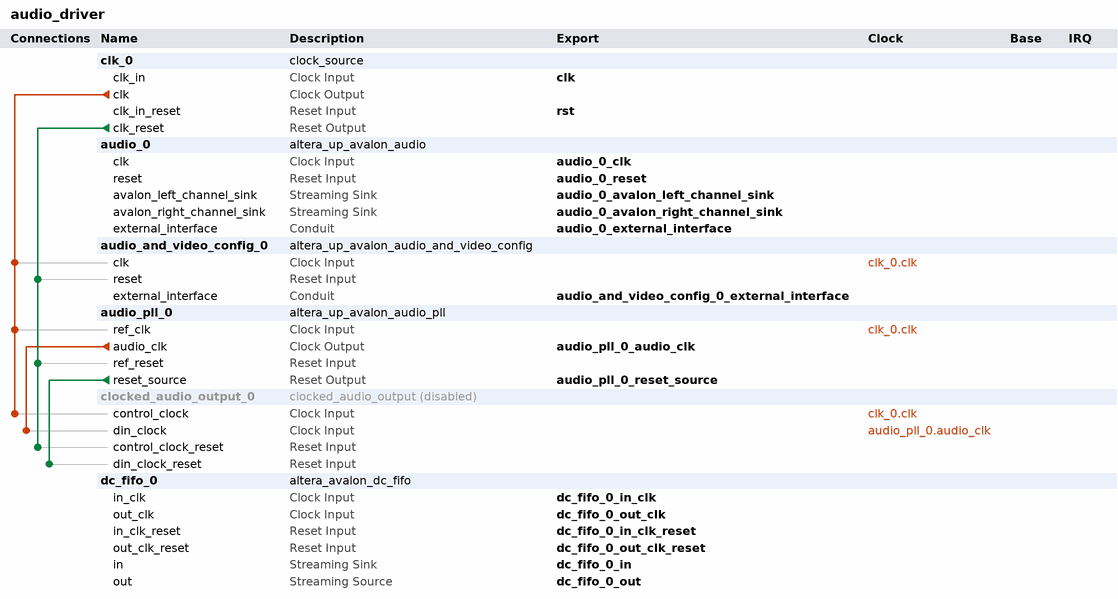
[diagram p0: system contents]
# Platform Designer (Qsys) system audio_driver, Cyclone V 5CSEMA5F31C6
# Parameters at their usual value, and those the tool derives, are not listed.
package require -exact qsys 18.0
create_system audio_driver
set_project_property DEVICE_FAMILY {Cyclone V}
set_project_property DEVICE 5CSEMA5F31C6

add_instance clk_0 clock_source 20.1
set_instance_parameter_value clk_0 clockFrequency 50000000

add_instance audio_0 altera_up_avalon_audio 18.0
set_instance_parameter_value audio_0 audio_in false
set_instance_parameter_value audio_0 avalon_bus_type Streaming
set_instance_parameter_value audio_0 dw 24

add_instance audio_and_video_config_0 altera_up_avalon_audio_and_video_config 18.0
set_instance_parameter_value audio_and_video_config_0 audio_in {Microphone to ADC}
set_instance_parameter_value audio_and_video_config_0 bit_length 24
set_instance_parameter_value audio_and_video_config_0 board DE1-SoC
set_instance_parameter_value audio_and_video_config_0 line_in_bypass false
set_instance_parameter_value audio_and_video_config_0 sampling_rate {48 kHz}

add_instance audio_pll_0 altera_up_avalon_audio_pll 18.0
set_instance_parameter_value audio_pll_0 gui_refclk 50.0

add_instance clocked_audio_output_0 clocked_audio_output 20.1
set_instance_property clocked_audio_output_0 ENABLED false
set_instance_parameter_value clocked_audio_output_0 FAMILY {Cyclone V}
set_instance_parameter_value clocked_audio_output_0 G_CAO_FIFO_DEPTH 5
set_instance_parameter_value clocked_audio_output_0 G_CAO_INCLUDE_CTRL_REG 0

add_instance dc_fifo_0 altera_avalon_dc_fifo 20.1
set_instance_parameter_value dc_fifo_0 BITS_PER_SYMBOL 24
set_instance_parameter_value dc_fifo_0 FIFO_DEPTH 16
set_instance_parameter_value dc_fifo_0 USE_PACKETS 0

# connections
add_connection audio_pll_0.audio_clk clocked_audio_output_0.din_clock clock
add_connection clk_0.clk audio_and_video_config_0.clk clock
add_connection clk_0.clk audio_pll_0.ref_clk clock
add_connection clk_0.clk clocked_audio_output_0.control_clock clock
add_connection audio_pll_0.reset_source clocked_audio_output_0.din_clock_reset reset
add_connection clk_0.clk_reset audio_and_video_config_0.reset reset
add_connection clk_0.clk_reset audio_pll_0.ref_reset reset
add_connection clk_0.clk_reset clocked_audio_output_0.control_clock_reset reset

# exported interfaces
add_interface audio_0_avalon_left_channel_sink avalon_streaming sink
set_interface_property audio_0_avalon_left_channel_sink EXPORT_OF audio_0.avalon_left_channel_sink
add_interface audio_0_avalon_right_channel_sink avalon_streaming sink
set_interface_property audio_0_avalon_right_channel_sink EXPORT_OF audio_0.avalon_right_channel_sink
add_interface audio_0_clk clock sink
set_interface_property audio_0_clk EXPORT_OF audio_0.clk
add_interface audio_0_external_interface conduit end
set_interface_property audio_0_external_interface EXPORT_OF audio_0.external_interface
add_interface audio_0_reset reset sink
set_interface_property audio_0_reset EXPORT_OF audio_0.reset
add_interface audio_and_video_config_0_external_interface conduit end
set_interface_property audio_and_video_config_0_external_interface EXPORT_OF audio_and_video_config_0.external_interface
add_interface audio_pll_0_audio_clk clock source
set_interface_property audio_pll_0_audio_clk EXPORT_OF audio_pll_0.audio_clk
add_interface audio_pll_0_reset_source reset source
set_interface_property audio_pll_0_reset_source EXPORT_OF audio_pll_0.reset_source
add_interface clk clock sink
set_interface_property clk EXPORT_OF clk_0.clk_in
add_interface dc_fifo_0_in avalon_streaming sink
set_interface_property dc_fifo_0_in EXPORT_OF dc_fifo_0.in
add_interface dc_fifo_0_in_clk clock sink
set_interface_property dc_fifo_0_in_clk EXPORT_OF dc_fifo_0.in_clk
add_interface dc_fifo_0_in_clk_reset reset sink
set_interface_property dc_fifo_0_in_clk_reset EXPORT_OF dc_fifo_0.in_clk_reset
add_interface dc_fifo_0_out avalon_streaming source
set_interface_property dc_fifo_0_out EXPORT_OF dc_fifo_0.out
add_interface dc_fifo_0_out_clk clock sink
set_interface_property dc_fifo_0_out_clk EXPORT_OF dc_fifo_0.out_clk
add_interface dc_fifo_0_out_clk_reset reset sink
set_interface_property dc_fifo_0_out_clk_reset EXPORT_OF dc_fifo_0.out_clk_reset
add_interface rst reset sink
set_interface_property rst EXPORT_OF clk_0.clk_in_reset

set_interconnect_requirement {$system} qsys_mm.clockCrossingAdapter HANDSHAKE
set_interconnect_requirement {$system} qsys_mm.enableEccProtection FALSE
set_interconnect_requirement {$system} qsys_mm.insertDefaultSlave FALSE
set_interconnect_requirement {$system} qsys_mm.maxAdditionalLatency 1

save_system audio_driver.qsys
